# EAGLE design freeroute (EAGLE 5.06)
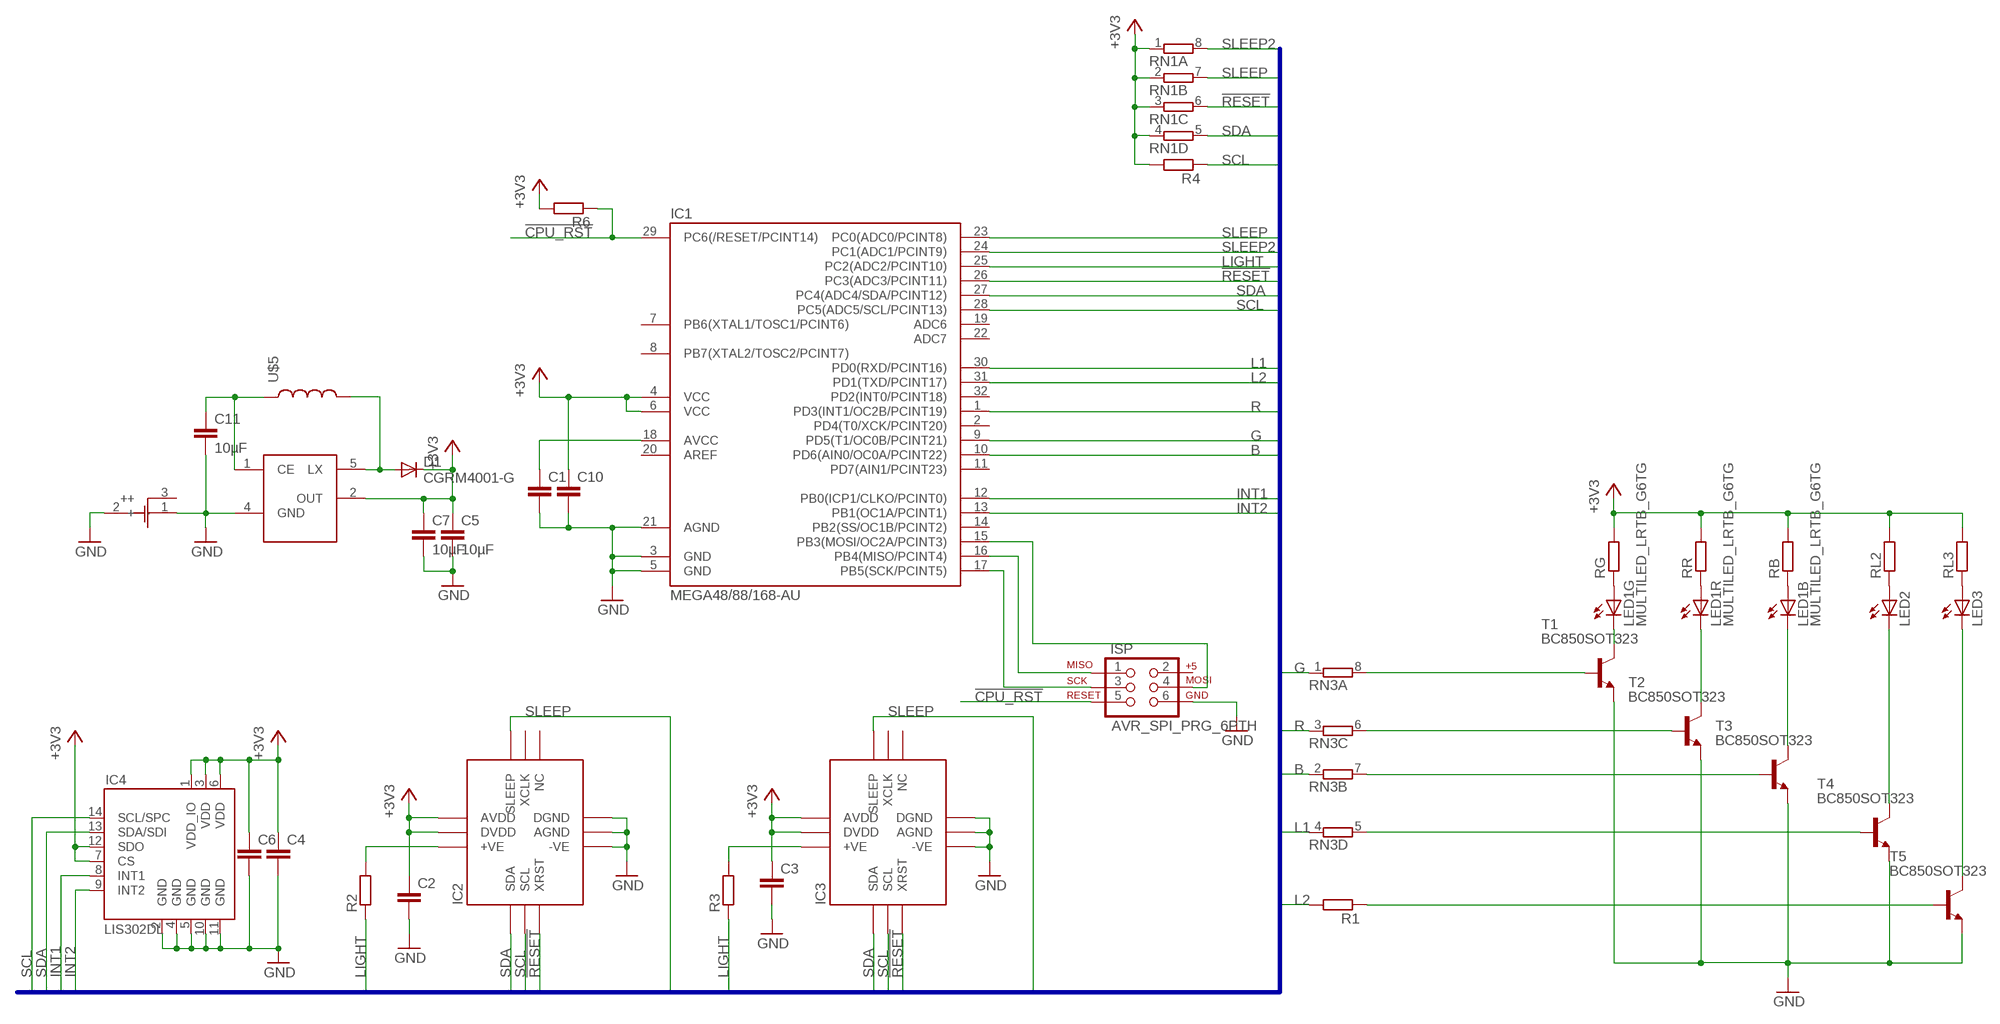
[diagram p0: schematic, sheet 1]

## Parts
C1  C-EUC0402  [C0402]
C2  C-EUC0402  [C0402]
C3  C-EUC0402  [C0402]
C4  C-EUC0402  [C0402]
C5  10µF  C-EUC0805  [C0805]
C6  C-EUC0805  [C0805]
C7  10µF  C-EUC0805  [C0805]
C10  C-EUC0402  [C0402]
C11  10µF  C-EUC0805  [C0805]
D1  CGRM4001-G  [SOD-123_MINI-SMA]
IC1  MEGA48/88/168-AU  [TQFP32-08]
IC2  ADJD_COLOR_SENSOR_SMD  [ADJD-S371]
IC3  ADJD_COLOR_SENSOR_SMD  [ADJD-S371]
IC4  LIS302DL  [LGA14]
ISP  AVR_SPI_PRG_6PTH  [2X3]
LED1  MULTILED_LRTB_G6TG  [P-LCC-6_TOPLED]
LED2  LEDCHIPLED_0603  [CHIPLED_0603]
LED3  LEDCHIPLED_0603  [CHIPLED_0603]
R1  R-EU_R0603  [R0603]
R2  R-EU_R0603  [R0603]
R3  R-EU_R0603  [R0603]
R4  R-EU_R0603  [R0603]
R6  R-EU_R0603  [R0603]
RB  R-EU_R0603  [R0603]
RG  R-EU_R0603  [R0603]
RL2  R-EU_R0603  [R0603]
RL3  R-EU_R0603  [R0603]
RN1  4R-NCAY16  [CAY16]
RN3  4R-NCAY16  [CAY16]
RR  R-EU_R0603  [R0603]
T1  BC850SOT323  [SOT323-BEC]
T2  BC850SOT323  [SOT323-BEC]
T3  BC850SOT323  [SOT323-BEC]
T4  BC850SOT323  [SOT323-BEC]
T5  BC850SOT323  [SOT323-BEC]
U$2  BATT  [BATTCOM_20MM_PTH]
U$4  NCP1402  [SOT23-5]
U$5  INDUCTORCDRH62B  [CDRH62BNP-470MC]

## Nets
!CPU_RST: IC1.29(PC6(/RESET/PCINT14)) ISP.5 R6.1
!RESET: IC1.26(PC3(ADC3/PCINT11)) IC2.10(XRST) IC3.10(XRST) RN1.6
+3V3: C2.1 C3.1 C4.1 C5.1 C6.1 C7.1 C10.1 D1.C IC1.4(VCC) IC1.6(VCC) IC2.5(DVDD) IC2.7(AVDD) IC3.5(DVDD) IC3.7(AVDD) IC4.1(VDD_IO) IC4.3(VDD) IC4.6(VDD) IC4.7(CS) IC4.12(SDO) R4.2 R6.2 RB.2 RG.2 RL2.2 RL3.2 RN1.1 RN1.2 RN1.3 RN1.4 RR.2 U$4.2(OUT)
B: IC1.10(PD6(AIN0/OC0A/PCINT22)) RN3.2
G: IC1.9(PD5(T1/OC0B/PCINT21)) RN3.1
GND: C1.2 C2.2 C3.2 C4.2 C5.2 C6.2 C7.2 C10.2 C11.2 IC1.3(GND) IC1.5(GND) IC1.21(AGND) IC2.1(-VE) IC2.9(AGND) IC2.11(DGND) IC3.1(-VE) IC3.9(AGND) IC3.11(DGND) IC4.2(GND) IC4.4(GND) IC4.5(GND) IC4.10(GND) IC4.11(GND) ISP.6 T1.E T2.E T3.E T4.E T5.E U$2.1(+) U$2.2(-) U$4.4(GND)
INT1: IC1.12(PB0(ICP1/CLKO/PCINT0)) IC4.8(INT1)
INT2: IC1.13(PB1(OC1A/PCINT1)) IC4.9(INT2)
L1: IC1.30(PD0(RXD/PCINT16)) RN3.4
L2: IC1.31(PD1(TXD/PCINT17)) R1.2
LIGHT: IC1.25(PC2(ADC2/PCINT10)) R2.1 R3.1
N$1: C1.1 IC1.18(AVCC)
N$3: RN3.7 T3.B
N$4: RN3.6 T2.B
N$5: IC1.17(PB5(SCK/PCINT5)) ISP.3
N$6: IC1.16(PB4(MISO/PCINT4)) ISP.1
N$10: LED1.C2(G:C) T1.C
N$11: LED1.C1(R:C) T2.C
N$12: LED1.C3(B:C) T3.C
N$13: IC2.3(+VE) R2.2
N$14: IC3.3(+VE) R3.2
N$15: IC1.15(PB3(MOSI/OC2A/PCINT3)) ISP.4
N$16: C11.1 U$4.1(CE) U$5.P$1
N$18: LED1.A2(G:A) RG.1
N$19: D1.A U$4.5(LX) U$5.P$2
N$22: RN3.8 T1.B
N$27: LED1.A1(R:A) RR.1
N$28: LED2.C T4.C
N$29: LED3.C T5.C
N$30: LED1.A3(B:A) RB.1
N$31: LED2.A RL2.1
N$32: LED3.A RL3.1
N$33: RN3.5 T4.B
N$34: R1.1 T5.B
R: IC1.1(PD3(INT1/OC2B/PCINT19)) RN3.3
SCL: IC1.28(PC5(ADC5/SCL/PCINT13)) IC2.6(SCL) IC3.6(SCL) IC4.14(SCL/SPC) R4.1
SDA: IC1.27(PC4(ADC4/SDA/PCINT12)) IC2.4(SDA) IC3.4(SDA) IC4.13(SDA/SDI) RN1.5
SLEEP: IC1.23(PC0(ADC0/PCINT8)) IC2.8(SLEEP) IC3.8(SLEEP) RN1.7
SLEEP2: IC1.24(PC1(ADC1/PCINT9)) RN1.8
Unconnected: IC1.2(PD4(T0/XCK/PCINT20)) IC1.7(PB6(XTAL1/TOSC1/PCINT6)) IC1.8(PB7(XTAL2/TOSC2/PCINT7)) IC1.11(PD7(AIN1/PCINT23)) IC1.14(PB2(SS/OC1B/PCINT2)) IC1.19(ADC6) IC1.20(AREF) IC1.22(ADC7) IC1.32(PD2(INT0/PCINT18)) IC2.2(NC) IC2.12(XCLK) IC3.2(NC) IC3.12(XCLK) ISP.2 U$2.3(++)

## Buses
COLOR:SDA,SCL,!RESET,LIGHT,SLEEP,INT1,INT2,R,G,B,L1,L2,PWR_SHN

## Library data of the parts
C1-C7 C10 C11 = rcl:C-EU: CAPACITOR, European symbol
D1 = diode:CGRM400*-G: Molded plasitc,JEDEC SOD-123/Mini SMA Source: Comchip CGRM4001-G.pdf
IC1 = avr-4:MEGA48/88/168
IC2 IC3 = SparkFun:ADJD_COLOR_SENSOR: Color Light Sensor ADJD-S371 from Avago. Digital RGB light sensor (I2C) with on-board white LED. Not quite proven footprint or schematic component. SKU: COM-08618
IC4 = SparkFunB:LIS302DL
ISP = SparkFun:AVR_SPI_PRG_6: AVR ISP 6 Pin This is the reduced ISP connector for AVR programming. Common on Arduino. This footprint will take up less PCB space and can be used with a 10-pin to 6-pin adapter such as SKU: BOB-08508
LED1 = led:MULTILED_LRTB_G6TG: 6-lead MULTILED® Enhanced optical Power LED (ThinFilm® / ThinGaN®) Source. OSRAM - LRTB_G6TG.pdf
LED2 LED3 = led:LED: LED OSRAM: - CHIPLED LG R971, LG N971, LY N971, LG Q971, LY Q971, LO R971, LY R971 LH N974, LH R974 LS Q976, LO Q976, LY Q976 LO Q996 - Hyper CHIPLED LW Q18S LB Q993, LB Q99A, LB R99A - SideLED LS A670, LO A670, LY A670, LG A670, LP A670 LB A673, LV A673, LT A673, LW A673 LH A674 LY A675 LS A676, LA A676, LO A676, LY A676, LW A676 LS A679, LY A679, LG A679 - Hyper Micro SIDELED® LS Y876, LA Y876, LO Y876, LY Y876 LT Y87S - SmartLED LW L88C, LW L88S LB L89C, LB L89S, LG L890 LS L89K, LO L89K, LY L89K LS L896, LA L896, LO L896, LY L896 - TOPLED LS T670, LO T670, LY T670, LG T670, LP T670 LSG T670, LSP T670, LSY T670, LOP T670, LYG T670 LG T671, LOG T671, LSG T671 LB T673, LV T673, LT T673, LW T673 LH T674 LS T676, LA T676, LO T676, LY T676, LB T676, LH T676, LSB T676, LW T676 LB T67C, LV T67C, LT T67C, LS T67K, LO T67K, LY T67K, LW E67C LS E67B, LA E67B, LO E67B, LY E67B, LB E67C, LV E67C, LT E67C LW T67C LS T679, LY T679, LG T679 LS T770, LO T770, LY T770, LG T770, LP T770 LB T773, LV T773, LT T773, LW T773 LH T774 LS E675, LA E675, LY E675, LS T675 LS T776, LA T776, LO T776, LY T776, LB T776 LHGB T686 LT T68C, LB T68C - Hyper Mini TOPLED® LB M676 - Mini TOPLED Santana® LG M470 LS M47K, LO M47K, LY M47K Source: http://www.osram.convergy.de LUXEON: - LUMILED® LXK2-PW12-R00, LXK2-PW12-S00, LXK2-PW14-U00, LXK2-PW14-V00 LXK2-PM12-R00, LXK2-PM12-S00, LXK2-PM14-U00 LXK2-PE12-Q00, LXK2-PE12-R00, LXK2-PE12-S00, LXK2-PE14-T00, LXK2-PE14-U00 LXK2-PB12-K00, LXK2-PB12-L00, LXK2-PB12-M00, LXK2-PB14-N00, LXK2-PB14-P00, LXK2-PB14-Q00 LXK2-PR12-L00, LXK2-PR12-M00, LXK2-PR14-Q00, LXK2-PR14-R00 LXK2-PD12-Q00, LXK2-PD12-R00, LXK2-PD12-S00 LXK2-PH12-R00, LXK2-PH12-S00 LXK2-PL12-P00, LXK2-PL12-Q00, LXK2-PL12-R00 Source: www.luxeon.com KINGBRIGHT: KA-3528ASYC Source: www.kingbright.com
R1-R4 R6 RB RG RL2 RL3 RR = rcl:R-EU_: RESISTOR, European symbol
RN1 RN3 = resistor-dil:4R-N: Array Chip Resistor Source: RS Component / Phycomp
T1-T5 = additional:BC850: NPN TRANSISTOR
U$2 = additional:BATT
U$4 = additional:NCP1402
U$5 = additional:INDUCTOR: Inductors Basic Inductor/Choke - 0603 and 1206. Footprints are not proven and vary greatly between part numbers.

## Board
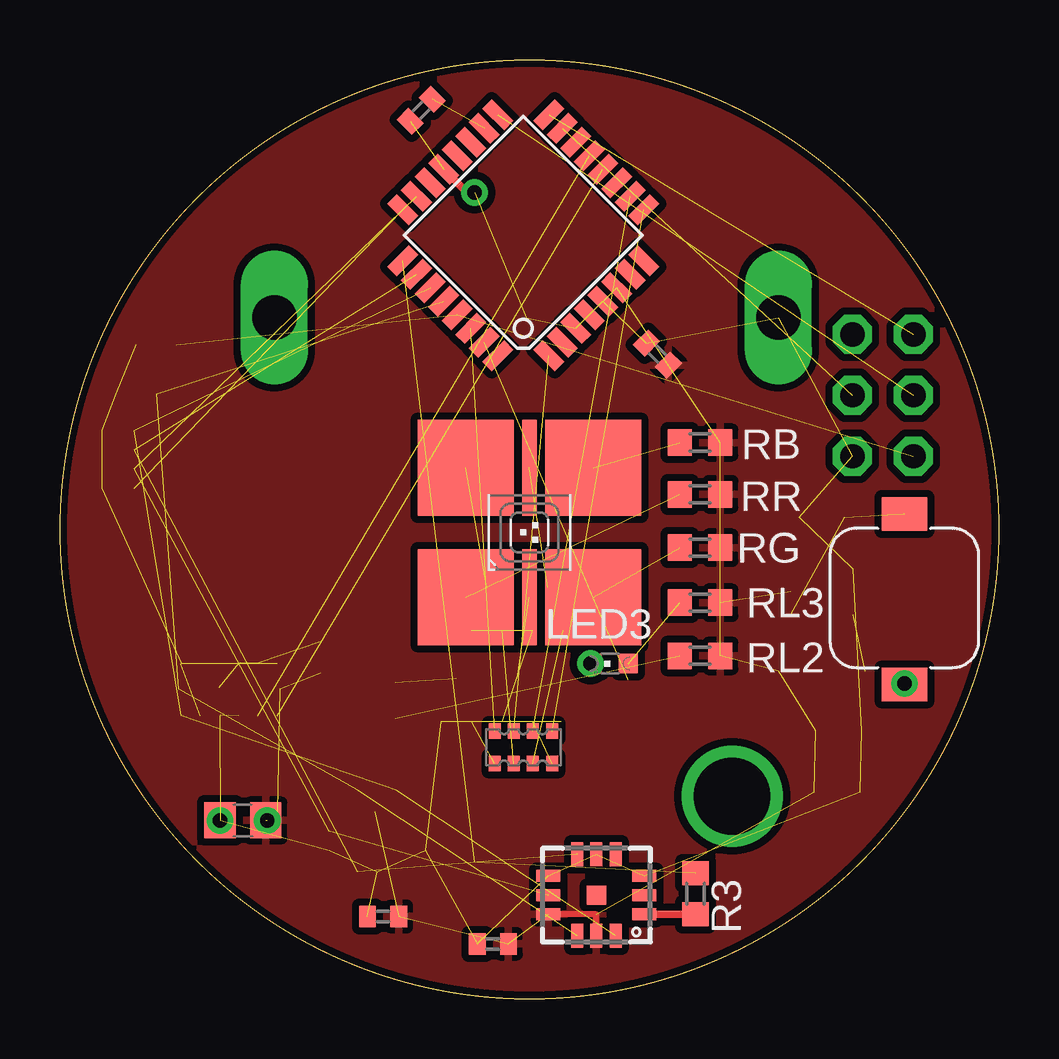
[diagram p1: board, top side]
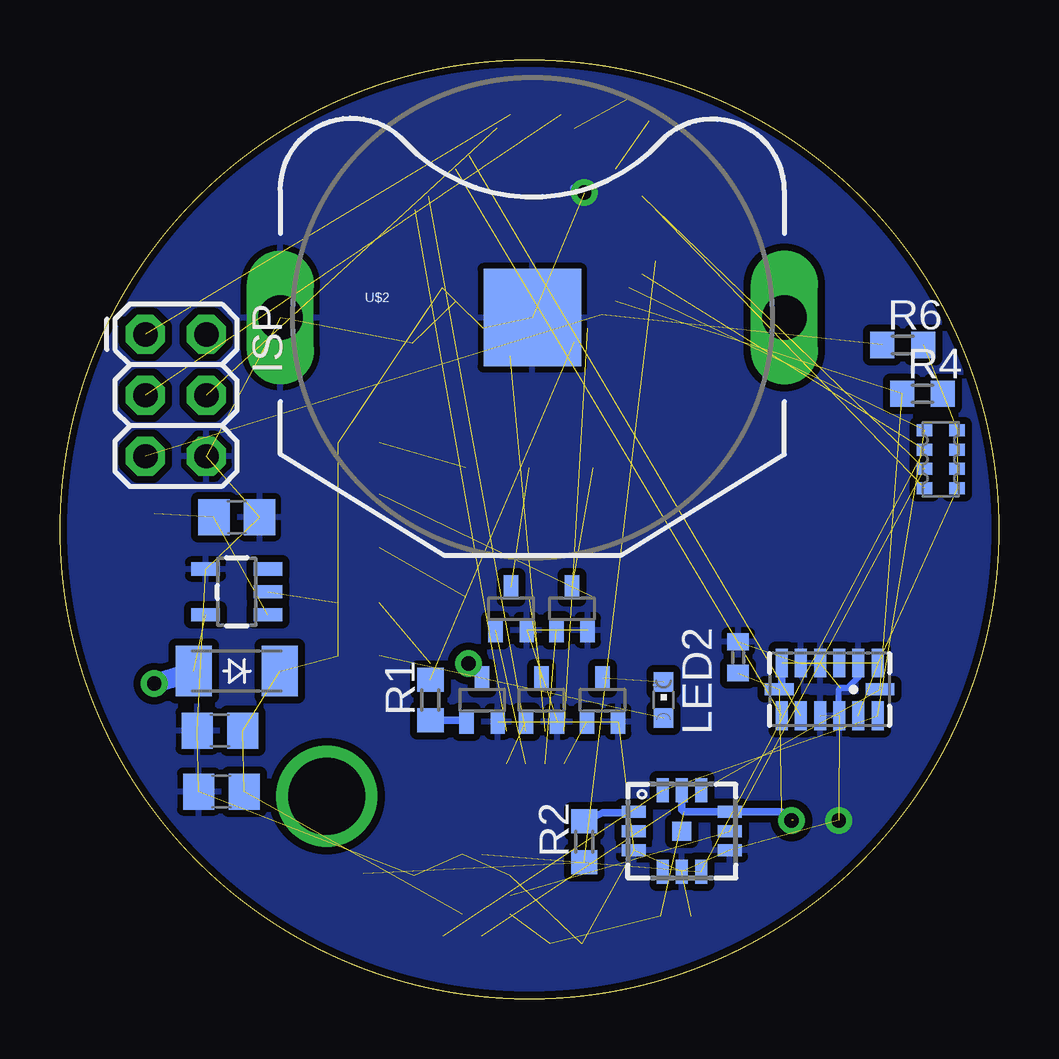
[diagram p2: board, bottom side, seen from below]

Size 39.12 x 39.12 mm. Coordinates in mm from the lower left corner, seen from the top.
Outline: circle at 19.56,19.56 radius 19.56
Copper layers (1*16): Top 0.035mm / dielectric 1.5mm / Bottom 0.035mm
Design rules "SparkFun *": minimum track width 8mil, minimum drill 20mil, track to track 8mil, track to pad 8mil, pad to pad 8mil, via to via 8mil, smd to smd 0mil, copper to edge 10mil, drill to drill 8mil, minimum pad ring 12mil, minimum via ring 10mil, stop-mask expansion 4mil, vias tented up to drill 25mil, thermal gap 10mil

### Footprints (pad centres in the part's own frame; a part is rotated, then mirrored left to right if it is on the bottom)
C0402 = smd 0.7 x 0.9: 1 -0.65,0; 2 0.65,0
C0805 = smd 1.3 x 1.5: 1 -0.95,0; 2 0.95,0
SOD-123_MINI-SMA = smd 1.5 x 2.1: A 1.8,0; C -1.8,0
TQFP32-08 = smd 1.27 x 0.559: 1 -4.293,2.8; 2 -4.293,2; 3 -4.293,1.2; 4 -4.293,0.4; 5 -4.293,-0.4; 6 -4.293,-1.2; 7 -4.293,-2; 8 -4.293,-2.8; 17 4.293,-2.8; 18 4.293,-2; 19 4.293,-1.2; 20 4.293,-0.4; 21 4.293,0.4; 22 4.293,1.2; 23 4.293,2; 24 4.293,2.8 | smd 0.559 x 1.27: 9 -2.8,-4.293; 10 -2,-4.293; 11 -1.2,-4.293; 12 -0.4,-4.293; 13 0.4,-4.293; 14 1.2,-4.293; 15 2,-4.293; 16 2.8,-4.293; 25 2.8,4.293; 26 2,4.293; 27 1.2,4.293; 28 0.4,4.293; 29 -0.4,4.293; 30 -1.2,4.293; 31 -2,4.293; 32 -2.8,4.293
ADJD-S371 = smd 1 x 0.5: 1 2,0.8; 2 2,0; 3 2,-0.8; 7 -2,-0.8; 8 -2,0; 9 -2,0.8 | smd 0.5 x 1: 4 0.8,-1.7; 5 0,-1.7; 6 -0.8,-1.7; 10 -0.8,1.7; 11 0,1.7; 12 0.8,1.7 | smd 0.8 x 0.8: PAD 0,0
LGA14 = smd 0.5 x 1.2: 1 2,1.1; 2 1.2,1.1; 3 0.4,1.1; 4 -0.4,1.1; 5 -1.2,1.1; 6 -2,1.1; 8 -2,-1.1; 9 -1.2,-1.1; 10 -0.4,-1.1; 11 0.4,-1.1; 12 1.2,-1.1; 13 2,-1.1 | smd 1.2 x 0.5: 7 -2.1,0; 14 2.1,0
2X3 = drill 1.016 octagon: 1 0,0; 2 0,2.54; 3 2.54,0; 4 2.54,2.54; 5 5.08,0; 6 5.08,2.54
P-LCC-6_TOPLED = smd 4 x 4: A1 -2.65,-2.7; A2 2.65,-2.7; A3 2.65,2.7; C1 -2.65,2.7 | smd 0.6 x 4: C2 0,-2.7; C3 0,2.7
CHIPLED_0603 = smd 0.8 x 0.8: A 0,-0.75; C 0,0.75
R0603 = smd 1 x 1.1: 1 -0.85,0; 2 0.85,0
CAY16 = smd 0.5 x 0.65: 1 -1.2,-0.675; 2 -0.4,-0.675; 3 0.4,-0.675; 4 1.2,-0.675; 5 1.2,0.675; 6 0.4,0.675; 7 -0.4,0.675; 8 -1.2,0.675
SOT323-BEC = smd 0.6 x 1: B -0.65,-0.9; C 0,0.9; E 0.65,-0.9
BATTCOM_20MM_PTH = drill 1.854 long: 1 -10.5,0; 3 10.5,0 | smd 4.064 x 4.064: 2 0,0
SOT23-5 = smd 0.55 x 1.2: 1 -0.95,-1.3; 2 0,-1.3; 3 0.95,-1.3; 4 0.95,1.3; 5 -0.95,1.3
CDRH62BNP-470MC = smd 1.9 x 1.4: P$1 0,-3.5; P$2 0,3.6

### Placement (x,y rotation side)
C1  15.05,37.02 225 top
C2  13.46,3.43 180 top
C3  18.03,2.29 180 top
C4  10.86,14.22 90 bottom
C5  32.45,11.18 180 bottom
C6  7.62,7.43 180 top
C7  32.39,8.64 180 bottom
C10  24.89,26.86 135 top
C11  31.75,20.07 0 bottom
D1  31.75,13.65 180 bottom
IC1  19.3,31.81 135 top
IC2  13.21,6.99 180 bottom
IC3  22.35,4.32 0 top
IC4  7.05,12.89 0 bottom
ISP  35.56,27.69 270 bottom
LED1  19.56,19.43 0 top
LED2  13.97,12.45 0 bottom
LED3  22.92,13.97 90 top
R1  23.69,12.45 90 bottom
R2  17.27,6.54 90 bottom
R3  26.48,4.38 270 top
R4  3.18,25.21 0 bottom
R6  4,27.24 0 bottom
RB  26.67,23.18 0 top
RG  26.67,18.8 0 top
RL2  26.67,14.29 0 top
RL3  26.67,16.51 0 top
RN1  2.41,22.48 90 bottom
RN3  19.3,10.48 180 top
RR  26.67,21.02 0 top
T1  19.05,12.45 0 bottom
T2  17.78,16.26 0 bottom
T3  20.32,16.26 0 bottom
T4  16.51,12.45 0 bottom
T5  21.53,12.45 0 bottom
U$2  19.43,28.38 0 bottom
U$4  31.75,16.95 90 bottom
U$5  35.18,16.7 180 top

### Tracks (layer width: path | path; a pad name or v marks a point on that pad's centre or on a via)
!CPU_RST  (2 unrouted)
!RESET  (3 unrouted)
+3V3  (via drill 0.6)  (27 unrouted)
  Top 0.254: IC3.7 22.35,3.52 IC3.5
  Top 0.305: v8.64,7.43 8.64,7.37
  Bottom 0.305: IC4.6 9.05,12.99 IC4.7 | IC2.5 13.21,7.87 13.12,7.79 IC2.7 9.06,7.79 v8.64,7.43 | IC4.1 5.03,13.97
  pour Top (isolate 0.305): 0.06,39.18 39.37,39.18 39.37,-0.19 0,-0.25
B  (1 unrouted)
G  (1 unrouted)
GND  (via drill 0.6)  (30 unrouted)
  Top 0.254: C6.2
  Top 0.305: IC1.21 16.96,33.59 v17.27,33.59
  Bottom 0.254: IC4.2 5.85,13.39 6.29,12.95 6.6,12.95 6.67,12.89 6.67,11.81 IC4.11
  Bottom 0.305: v17.27,33.59 17.46,33.78 17.72,33.78
  other vias: 6.67,7.43
  pour Bottom (isolate 0.305): -1.4,40.39 40.64,40.39 40.64,-1.52 -1.4,-1.52
INT1  (1 unrouted)
INT2  (1 unrouted)
L1  (1 unrouted)
L2  (1 unrouted)
LIGHT  (2 unrouted)
N$1  (1 unrouted)
N$2  (via drill 3.2)
  other vias: 28,8.45
N$3  (1 unrouted)
N$4  (1 unrouted)
N$5  (1 unrouted)
N$6  (1 unrouted)
N$10  (1 unrouted)
N$11  (1 unrouted)
N$12  (1 unrouted)
N$13
  Bottom 0.305: R2.2 16.51,7.75 15.25,7.75 IC2.3
N$14
  Top 0.305: IC3.3 26.47,3.52 R3.2
N$15  (1 unrouted)
N$16  (2 unrouted)
N$18  (1 unrouted)
N$19  (via drill 0.6)  (1 unrouted)
  Top 0.813: v35.19,13.13 U$5.P$2
  Bottom 0.813: D1.A v35.19,13.13
N$22  (1 unrouted)
N$27  (1 unrouted)
N$28  (1 unrouted)
N$29  (via drill 0.6)
  Top 0.305: v22.1,13.97 LED3.C
  Bottom 0.305: v22.1,13.97 21.64,13.46 T5.C
N$30  (1 unrouted)
N$31  (1 unrouted)
N$32  (1 unrouted)
N$33  (1 unrouted)
N$34
  Bottom 0.305: R1.1 22.23,11.6 T5.B
R  (1 unrouted)
SCL  (4 unrouted)
SDA  (4 unrouted)
SLEEP  (3 unrouted)
SLEEP2  (1 unrouted)